# Altium schematic sheet DD2090_4CAM_FFC_Connector_B.SchDoc: =project_title
size Tabloid; CompanyName: Luxonis Holding; Organization: Luxonis Holding; Address1: 1925 Harmony Park Drive; Address2: Westminster, CO; Address3: 80234; Address4: United States; SheetNumber: 4; SheetTotal: 12
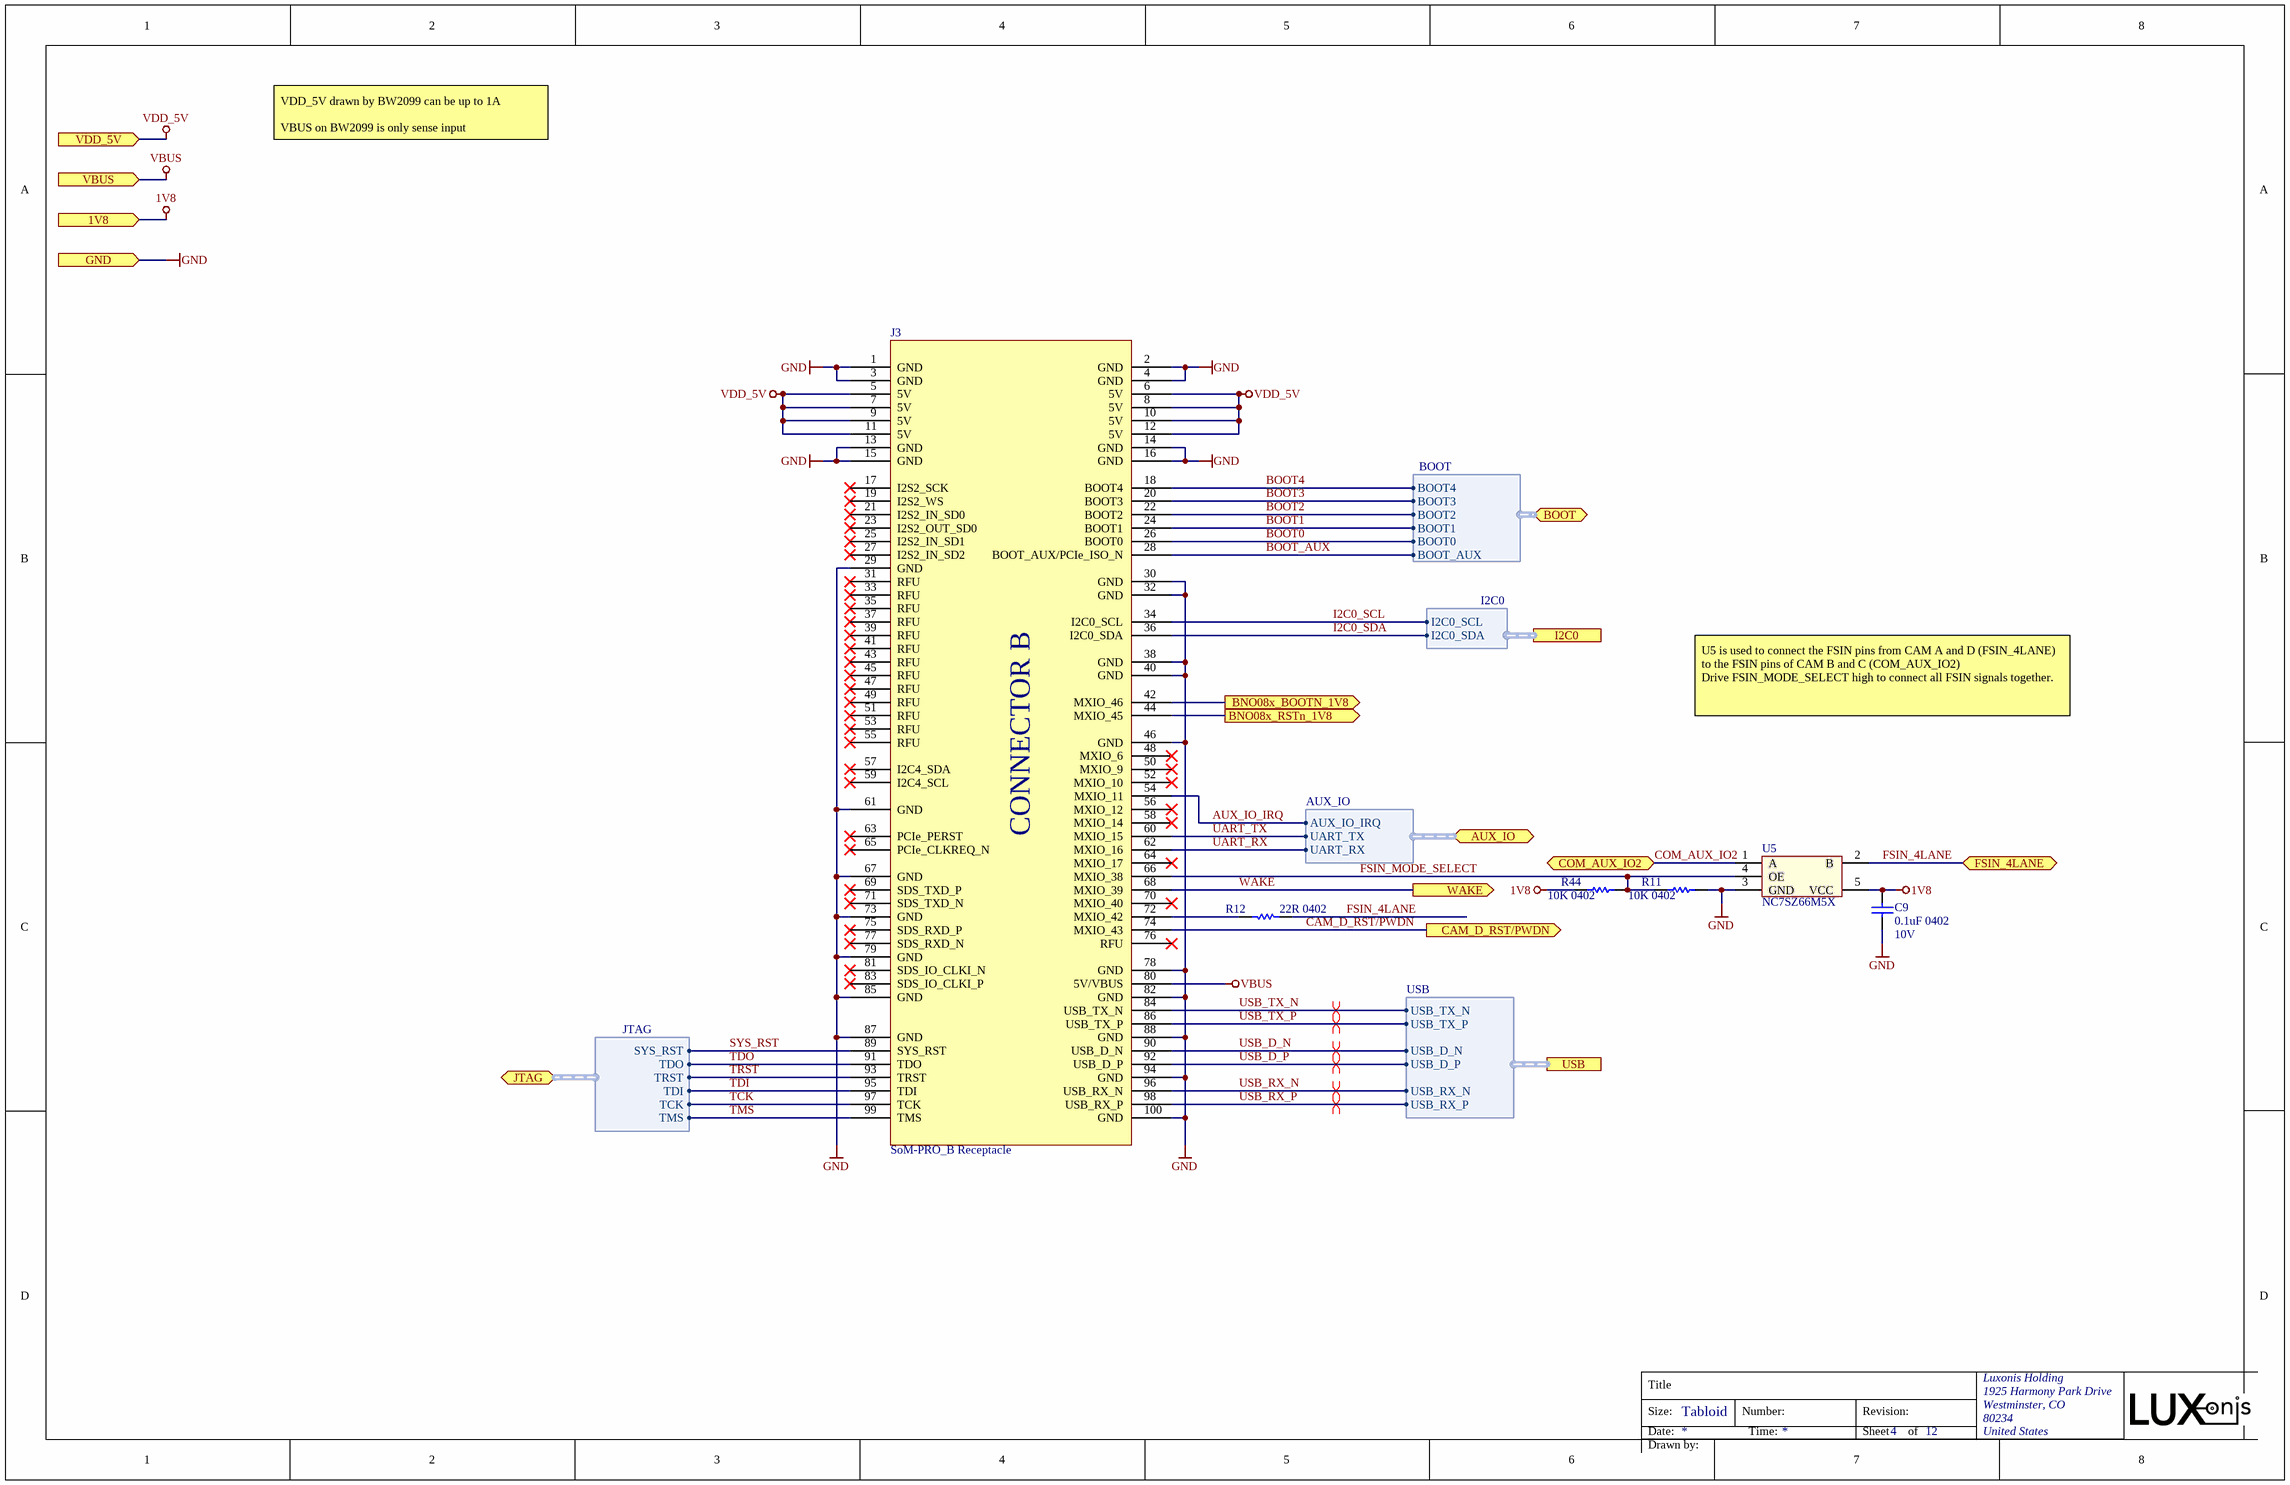
[diagram p0: DD2090_4CAM_FFC_Connector_B.SchDoc]

## Parts
C9  0.1uF 0402  Voltage Rating: 10V  [CAPC0402(1005)70_L]
J3  SoM-PRO_B Receptacle  [CON_B_BW2099_SoM_DF40HC-3.0-100DS-0.4V_minpad]
R11  10K 0402  [RESC0402(1005)_L]
R12  22R 0402  [RESC0402(1005)_N]
R44  10K 0402  [RESC0402(1005)_L]
U5  NC7SZ66M5X  [SOT235]

## Ports
1V8 (in), AUX_IO (bidir, harness AUX_IO), BNO08x_BOOTN_1V8 (out), BNO08x_RSTn_1V8 (out), BOOT (bidir, harness BOOT), CAM_D_RST/PWDN (out), COM_AUX_IO2 (bidir), FSIN_4LANE (bidir), GND (in), I2C0 (harness I2C0), JTAG (bidir, harness JTAG), USB (harness USB), VBUS (in), VDD_5V (in), WAKE (out)

## Harnesses
JTAG: SYS_RST, TDO, TRST, TDI, TCK, TMS
USB: USB_TX_N, USB_TX_P, USB_RX_N, USB_RX_P, USB_D_P, USB_D_N
BOOT: BOOT4, BOOT3, BOOT2, BOOT1, BOOT0, BOOT_AUX
AUX_IO: AUX_IO_IRQ, UART_TX, UART_RX
I2C0: I2C0_SCL, I2C0_SDA

## Nets
1V8: C9.2 R44.2 U5.5(VCC) ; port 1V8
GND: C9.1 J3.1(GND) J3.2(GND) J3.3(GND) J3.4(GND) J3.13(GND) J3.14(GND) J3.15(GND) J3.16(GND) J3.29(GND) J3.30(GND) J3.32(GND) J3.38(GND) J3.40(GND) J3.46(GND) J3.61(GND) J3.67(GND) J3.73(GND) J3.78(GND) J3.79(GND) J3.82(GND) J3.85(GND) J3.87(GND) J3.88(GND) J3.94(GND) J3.100(GND) R11.1 U5.3(GND) ; port GND
VBUS: J3.80(5V/VBUS) ; port VBUS
VDD_5V: J3.5(5V) J3.6(5V) J3.7(5V) J3.8(5V) J3.9(5V) J3.10(5V) J3.11(5V) J3.12(5V) ; port VDD_5V
AUX_IO_IRQ: J3.54(MXIO_11) ; port AUX_IO.AUX_IO_IRQ
BNO08x_BOOTN_1V8: J3.42(MXIO_46) ; port BNO08x_BOOTN_1V8
BNO08x_RSTn_1V8: J3.44(MXIO_45) ; port BNO08x_RSTn_1V8
BOOT0: J3.26(BOOT0) ; port BOOT.BOOT0
BOOT1: J3.24(BOOT1) ; port BOOT.BOOT1
BOOT2: J3.22(BOOT2) ; port BOOT.BOOT2
BOOT3: J3.20(BOOT3) ; port BOOT.BOOT3
BOOT4: J3.18(BOOT4) ; port BOOT.BOOT4
BOOT_AUX: J3.28(BOOT_AUX/PCIe_ISO_N) ; port BOOT.BOOT_AUX
CAM_D_RST/PWDN: J3.74(MXIO_43) ; port CAM_D_RST/PWDN
COM_AUX_IO2: U5.1(A) ; port COM_AUX_IO2
FSIN_4LANE: R12.1 U5.2(B) ; port FSIN_4LANE
FSIN_MODE_SELECT: J3.66(MXIO_38) R11.2 R44.1 U5.4(OE)
I2C0_SCL: J3.34(I2C0_SCL) ; port I2C0.I2C0_SCL
I2C0_SDA: J3.36(I2C0_SDA) ; port I2C0.I2C0_SDA
SYS_RST: J3.89(SYS_RST) ; port JTAG.SYS_RST
TCK: J3.97(TCK) ; port JTAG.TCK
TDI: J3.95(TDI) ; port JTAG.TDI
TDO: J3.91(TDO) ; port JTAG.TDO
TMS: J3.99(TMS) ; port JTAG.TMS
TRST: J3.93(TRST) ; port JTAG.TRST
UART_RX: J3.62(MXIO_16) ; port AUX_IO.UART_RX
UART_TX: J3.60(MXIO_15) ; port AUX_IO.UART_TX
USB_D_N: J3.90(USB_D_N) ; port USB.USB_D_N
USB_D_P: J3.92(USB_D_P) ; port USB.USB_D_P
USB_RX_N: J3.96(USB_RX_N) ; port USB.USB_RX_N
USB_RX_P: J3.98(USB_RX_P) ; port USB.USB_RX_P
USB_TX_N: J3.84(USB_TX_N) ; port USB.USB_TX_N
USB_TX_P: J3.86(USB_TX_P) ; port USB.USB_TX_P
WAKE: J3.68(MXIO_39) ; port WAKE
NetJ3_72: J3.72(MXIO_42) R12.2

Not connected (* = marked no-connect by the designer): J3 17(I2S2_SCK)* 19(I2S2_WS)* 21(I2S2_IN_SD0)* 23(I2S2_OUT_SD0)* 25(I2S2_IN_SD1)* 27(I2S2_IN_SD2)* 31(RFU)* 33(RFU)* 35(RFU)* 37(RFU)* 39(RFU)* 41(RFU)* 43(RFU)* 45(RFU)* 47(RFU)* 48(MXIO_6)* 49(RFU)* 50(MXIO_9)* 51(RFU)* 52(MXIO_10)* 53(RFU)* 55(RFU)* 56(MXIO_12)* 57(I2C4_SDA)* 58(MXIO_14)* 59(I2C4_SCL)* 63(PCIe_PERST)* 64(MXIO_17)* 65(PCIe_CLKREQ_N)* 69(SDS_TXD_P)* 70(MXIO_40)* 71(SDS_TXD_N)* 75(SDS_RXD_P)* 76(RFU)* 77(SDS_RXD_N)* 81(SDS_IO_CLKI_N)* 83(SDS_IO_CLKI_P)*

## Layout directives
differential pair; differential pair class 90ohm: USB_D_N, USB_D_P, USB_RX_N, USB_RX_P, USB_TX_N, USB_TX_P

## Notes on the sheet
- VDD_5V drawn by BW2099 can be up to 1A
  VBUS on BW2099 is only sense input
- U5 is used to connect the FSIN pins from CAM A and D (FSIN_4LANE) to the FSIN pins of CAM B and C (COM_AUX_IO2)
  Drive FSIN_MODE_SELECT high to connect all FSIN signals together.
- Title
- Size:
- Date:
- Tabloid
- Number:
- Time:
- Revision:
- Sheet
- of
- Drawn by:
- (in symbol DF40HC(3.0)-100DS-0.4V_SoM-PRO_B) CONNECTOR B

## Library data of the parts
C9 = GRM155R71A104JA01D: CAP CER 0.1UF 10V X7R 0402 5%; Manufacturer 1: Murata; Capacitance: 100nF; Supplier 1: Digi-Key; Manufacturer Part Number 1: GRM155R71A104JA01D; Stock 1: 1346709; Pricing 1: 1=0.10000, 10=0.02500, 100=0.01130, 500=0.00806, 1000=0.00633, 2500=0.00575, 5000=0.00529 (USD); RoHS: Yes; Mount: Surface Mount; Case/Package: 0402; Case Code (Imperial): 0402; Case Code (Metric): 1005; Min Operating Temperature: -55°C; Max Operating Temperature: 125°C; Tolerance: 5%; Packaging: Tape and Reel; Voltage Rating (DC): 10V; Dielectric: X7R; Package Quantity: 10000; Termination: SMD/SMT; Length: 1mm; Height: 0.5mm; Width: 0.02inch; Thickness: 0.022inch; Depth: 0.5mm; Radiation Hardening: No; Lead Free: Lead Free; ComponentLink1URL: https://datasheet.ciiva.com/5411/product-5411135.pdf?src-supplier=Mouser; ComponentLink1Description: https://datasheet.ciiva.com/5411/product-5411135.pdf?src-supplier=Mouser; ComponentLink2URL: https://datasheet.ciiva.com/11618/c02e-11618821.pdf?src-supplier=Avnet; ComponentLink2Description: https://datasheet.ciiva.com/11618/c02e-11618821.pdf?src-supplier=Avnet; Supplier Part Number 1: 490-10777-1-ND
J3 = DF40HC(3.0)-100DS-0.4V_SoM-PRO_B: CONN RCPT 100POS 0.4MM SMD GOLD; Manufacturer 1: Hirose; Manufacturer Part Number 1: DF40HC(3.0)-100DS-0.4V(58); Number of Positions: 100; Pitch: 0.016inch; System: Connector; RoHS: Yes; Mount: Surface Mount; Contact Plating: Gold; Packaging: Tape and Reel; Number of Rows: 2; Package Quantity: 1000; Connector Type: Receptacle; Lead Free: Lead Free; ComponentLink1URL: https://datasheet.ciiva.com/46636/ed-df40-20140305-46636517.pdf?src-supplier=Digi-Key; ComponentLink1Description: https://datasheet.ciiva.com/46636/ed-df40-20140305-46636517.pdf?src-supplier=Digi-Key; ComponentLink2URL: https://datasheet.ciiva.com/18562/ed-df40-20140305-18562189.pdf?src-supplier=Digi-Key; ComponentLink2Description: https://datasheet.ciiva.com/18562/ed-df40-20140305-18562189.pdf?src-supplier=Digi-Key; ComponentLink3URL: https://datasheet.ciiva.com/13559/ed-df40-20140305-13559540.pdf?src-supplier=Mouser; ComponentLink3Description: https://datasheet.ciiva.com/13559/ed-df40-20140305-13559540.pdf?src-supplier=Mouser; ComponentLink4URL: https://datasheet.ciiva.com/18562/ed-df40-20140305-18562462.pdf?src-supplier=Digi-Key; ComponentLink4Description: https://datasheet.ciiva.com/18562/ed-df40-20140305-18562462.pdf?src-supplier=Digi-Key; Supplier 1: Mouser; Stock 1: 2172; Pricing 1: 1=2.54000, 10=2.26000, 25=2.07000, 50=2.07000, 100=1.98000, 250=1.79000, 500=1.65000, 1000=1.41000, 3000=1.32000, 6000=1.23000, 10000=1.23000 (USD); Supplier 2: Mouser; Stock 2: 2078; Pricing 2: 1=2.50000, 10=2.40000, 25=2.10000, 50=2.10000, 100=2.00000, 250=1.76000, 500=1.71000, 1000=1.45000, 2000=1.36000, 5000=1.31000, 10000=1.31000 (USD); Supplier Part Number 1: 798-DF40HC30100DS451; Supplier Part Number 2: 798-DF40HC30100DS458
R11 R44 = RC0402FR-1310KL: RES SMD 10K OHM 1% 0402 1/16W Chip Resistor, 0402 [1005 Metric], 10 kohm, RC Series, 50 V, Thick Film, 62.5 mW; Manufacturer 1: Yageo; Resistance: 10kR; Temperature Coefficient: 100ppm/°C; Power Rating: 62.5mW; Voltage Rating: 50V; ComponentLink1URL: https://datasheet.ciiva.com/16940/pyu-rc0402-51-rohs-l-6-16940293.pdf?src-supplier=Avnet+Europe; ComponentLink1Description: https://datasheet.ciiva.com/16940/pyu-rc0402-51-rohs-l-6-16940293.pdf?src-supplier=Avnet+Europe; ComponentLink2URL: https://datasheet.ciiva.com/28386/pyu-rc0402-51-rohs-l-6-28386855.pdf?src-supplier=Avnet+Europe; ComponentLink2Description: https://datasheet.ciiva.com/28386/pyu-rc0402-51-rohs-l-6-28386855.pdf?src-supplier=Avnet+Europe; ComponentLink3URL: https://datasheet.ciiva.com/16740/pyu-rc0402-51-rohs-l-6-r-16740602.pdf?src-supplier=Future+Electronics; ComponentLink3Description: https://datasheet.ciiva.com/16740/pyu-rc0402-51-rohs-l-6-r-16740602.pdf?src-supplier=Future+Electronics; ComponentLink4URL: https://datasheet.ciiva.com/8891/pyu-rc0402-51-rohs-l-6-8891339.pdf?src-supplier=Avnet; ComponentLink4Description: https://datasheet.ciiva.com/8891/pyu-rc0402-51-rohs-l-6-8891339.pdf?src-supplier=Avnet; ComponentLink5URL: https://datasheet.ciiva.com/5557/pyu-rc0402-51-rohs-l-6-r-5557997.pdf?src-supplier=Mouser; ComponentLink5Description: https://datasheet.ciiva.com/5557/pyu-rc0402-51-rohs-l-6-r-5557997.pdf?src-supplier=Mouser; ComponentLink6URL: https://datasheet.ciiva.com/7983/1018594-7983533.pdf?src-supplier=Element14; ComponentLink6Description: https://datasheet.ciiva.com/7983/1018594-7983533.pdf?src-supplier=Element14; Supplier 1: Newark; Manufacturer Part Number 1: RC0402FR-1310KL; Stock 1: 62239; Pricing 1: 1=0.10000, 25=0.01200, 100=0.00400, 250=0.00400, 500=0.00300, 1000=0.00300 (USD); RoHS: Yes; Case/Package: 0402; Number of Pins: 2; Contact Plating: Tin,Matte,Lead; Case Code (Imperial): 0402; Case Code (Metric): 1005; Min Operating Temperature: -55°C; Max Operating Temperature: 155°C; Tolerance: 1%; Composition: Thick Film; Packaging: Tape and Reel; Termination: SMD/SMT; Military Standard: Not; Voltage Rating (DC): 50V; Working Voltage: 50V; Number of Terminations: 2; Length: 1mm; Depth: 0.5mm; Radiation Hardening: No; REACH SVHC: No SVHC; Lead Free: Lead Free; Supplier Part Number 1: 67R9960; Supplier 2: Future Electronics; Supplier 3: Mouser; Supplier 4: Element14; Supplier Part Number 2: RC0402FR-1310KL-CUTT; Supplier Part Number 3: 603-RC0402FR-1310KL; Supplier Part Number 4: 1799235
R12 = RC0402FR-0722RL: RES SMD 22 OHM 1% 1/16W 0402; Manufacturer 1: Yageo; Temperature Coefficient: 100ppm/°C; Power Rating: 63mW; Voltage Rating: 50V; Supplier 1: Digi-Key; Manufacturer Part Number 1: RC0402FR-0722RL; Stock 1: 23751364; Pricing 1: 10000=0.00163, 30000=0.00144, 50000=0.00132, 100000=0.00129 (USD); RoHS: Yes; Case/Package: 0402; Number of Pins: 2; Case Code (Metric): 1005; Case Code (Imperial): 0402; Min Operating Temperature: -55°C; Max Operating Temperature: 155°C; Tolerance: 1%; Resistance: 22R; Packaging: Tape and Reel; Composition: Thick Film; Voltage Rating (DC): 50V; Termination: SMD/SMT; Military Standard: Not; Length: 1mm; Height: 0.32mm; Width: 0.5mm; Depth: 0.5mm; REACH SVHC: Unknown; Lead Free: Lead Free; ComponentLink1URL: https://datasheet.ciiva.com/11819/0900766b80c66297-11819462.pdf?src-supplier=RSComponents; ComponentLink1Description: https://datasheet.ciiva.com/11819/0900766b80c66297-11819462.pdf?src-supplier=RSComponents; ComponentLink2URL: https://datasheet.ciiva.com/7849/1018594-7849911.pdf?src-supplier=Element14; ComponentLink2Description: https://datasheet.ciiva.com/7849/1018594-7849911.pdf?src-supplier=Element14; ComponentLink3URL: https://datasheet.ciiva.com/26829/getdatasheetpartid-554995-26829991.pdf?src-supplier=Verical; ComponentLink3Description: https://datasheet.ciiva.com/26829/getdatasheetpartid-554995-26829991.pdf?src-supplier=Verical; ComponentLink4URL: https://datasheet.ciiva.com/7849/1018594-7849912.pdf?src-supplier=Element14; ComponentLink4Description: https://datasheet.ciiva.com/7849/1018594-7849912.pdf?src-supplier=Element14; ComponentLink5URL: https://datasheet.ciiva.com/16930/pyu-rc0402-51-rohs-l-6-r-16930687.pdf?src-supplier=Future+Electronics; ComponentLink5Description: https://datasheet.ciiva.com/16930/pyu-rc0402-51-rohs-l-6-r-16930687.pdf?src-supplier=Future+Electronics; Supplier 2: Newark; Supplier 3: Mouser; Supplier Part Number 2: 26M6784; Supplier Part Number 3: 603-RC0402FR-0722RL; Supplier Part Number 1: 311-22.0LRTR-ND
U5 = NC7SZ66M5X: ANALOGUE SWITCH, SINGLE, SPST-NO, SOT-23; Analog Switch Type:SPST - NO; No. of Channels:1; On State Resistance Max:60ohm; Supply Voltage Range:1.65V to 5.5V; Analog Switch Case:SOT-23; No. of Pins:5; Operating Temperature Min:-40 C ;RoHS Compliant: Yes; Manufacturer 1: ON Semiconductor / Fairchild; Min Supply Voltage: 1.65V; Max Power Dissipation: 200mW; On-State Resistance: 5R; Turn-On Delay Time: 7ns; Turn-Off Delay Time: 9.2ns; Number of Channels: 1; Max Supply Current: 10uA; Throw Configuration: SPST; High Level Output Current: 128mA; Quiescent Current: 50nA; Polarity: Non-Inverting; Voltage: 5V; Supplier 1: Digi-Key; Manufacturer Part Number 1: NC7SZ66M5X; RoHS: Yes; Category: Decoders and Multiplexers; Stock 1: 12120; Pricing 1: 1=0.39000, 10=0.32000, 25=0.29280, 100=0.21780, 250=0.19736, 500=0.16332, 1000=0.12249 (USD); Mount: Surface Mount; Case/Package: SOT-23-5; Number of Pins: 5; Weight: 0.001058oz; Contact Plating: Tin,Matte; Min Operating Temperature: -40°C; Max Operating Temperature: 85°C; Packaging: Tape and Reel; Max Supply Voltage: 5.5V; Package Quantity: 1; Supply Type: Single; Number of Inputs: 1; Number of Outputs: 1; Independent Circuits: 1; Power Dissipation: 200mW; Number of Circuits: 1; Number of Bits: 1; Length: 3mm; Width: 1.7mm; Height: 1.3mm; Radiation Hardening: No; RoHS Compliant: Yes; Lead Free: Lead Free; REACH SVHC: No SVHC; ComponentLink1URL: https://datasheet.ciiva.com/4917/nc7sz66-98769-4917648.pdf?src-supplier=Mouser; ComponentLink1Description: https://datasheet.ciiva.com/4917/nc7sz66-98769-4917648.pdf?src-supplier=Mouser; ComponentLink2URL: https://datasheet.ciiva.com/15127/getdatasheetpartid-142529-15127273.pdf?src-supplier=Verical; ComponentLink2Description: https://datasheet.ciiva.com/15127/getdatasheetpartid-142529-15127273.pdf?src-supplier=Verical; ComponentLink3URL: https://datasheet.ciiva.com/34301/1021815-34301882.pdf?src-supplier=Jameco; ComponentLink3Description: https://datasheet.ciiva.com/34301/1021815-34301882.pdf?src-supplier=Jameco; ComponentLink4URL: https://datasheet.ciiva.com/1514/1751945-1514528.pdf?src-supplier=Element14; ComponentLink4Description: https://datasheet.ciiva.com/1514/1751945-1514528.pdf?src-supplier=Element14; ComponentLink5URL: https://datasheet.ciiva.com/2980/nc7sz66-2980326.pdf?src-supplier=Avnet; ComponentLink5Description: https://datasheet.ciiva.com/2980/nc7sz66-2980326.pdf?src-supplier=Avnet; ComponentLink6URL: https://datasheet.ciiva.com/26240/nc7sz66-26240518.pdf?src-supplier=Avnet+Europe; ComponentLink6Description: https://datasheet.ciiva.com/26240/nc7sz66-26240518.pdf?src-supplier=Avnet+Europe; ComponentLink7URL: https://datasheet.ciiva.com/1888/nc7sz66-1888140.pdf?src-supplier=Digi-Key; ComponentLink7Description: https://datasheet.ciiva.com/1888/nc7sz66-1888140.pdf?src-supplier=Digi-Key; ComponentLink8URL: https://datasheet.ciiva.com/1888/nc7sz66-1888141.pdf?src-supplier=Digi-Key; ComponentLink8Description: https://datasheet.ciiva.com/1888/nc7sz66-1888141.pdf?src-supplier=Digi-Key; ComponentLink9URL: https://datasheet.ciiva.com/1888/nc7sz66-1888142.pdf?src-supplier=Digi-Key; ComponentLink9Description: https://datasheet.ciiva.com/1888/nc7sz66-1888142.pdf?src-supplier=Digi-Key